# Altium schematic sheet Sheet_1 copy.schdoc
size 438 x 285 mm
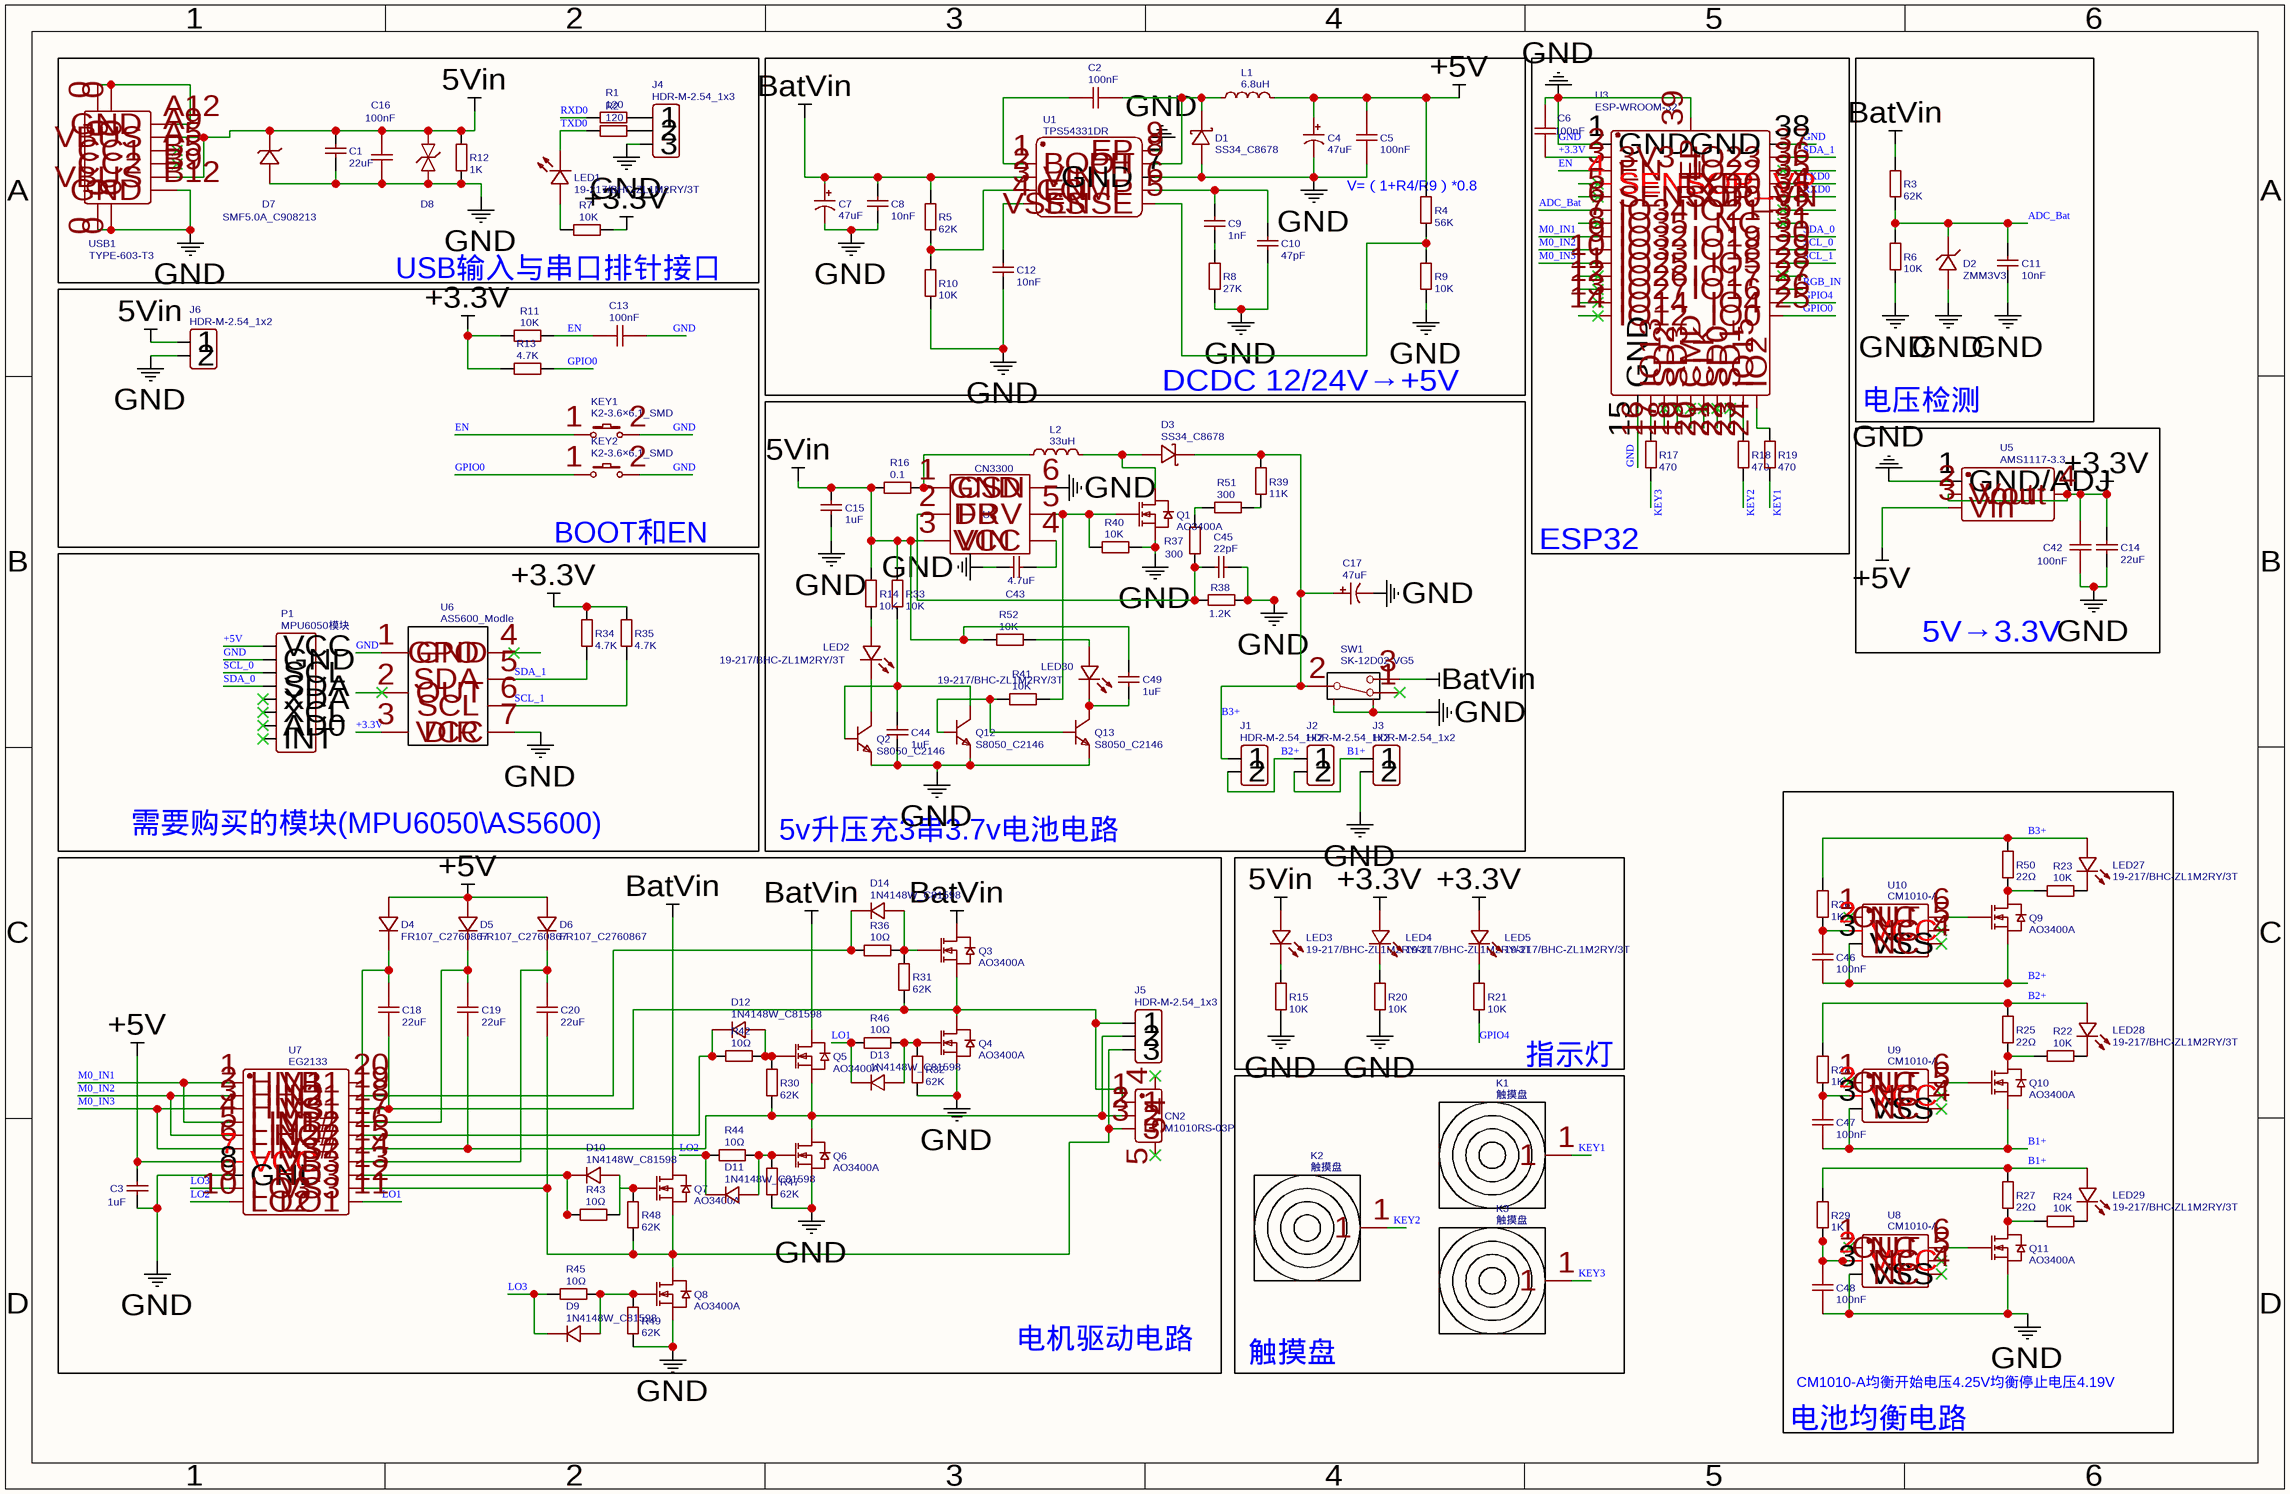
[diagram p0: Sheet_1 copy.schdoc]

## Parts
C1  22uF  [C1206]
C2  100nF  [C0603]
C3  1uF  [C0603]
C4  47uF  [CAP-SMD_BD5.0-L5.3-W5.3-RD]
C5  100nF  [C0603]
C6  100nF  [C0603]
C7  47uF  [CAP-SMD_BD5.0-L5.3-W5.3-RD]
C8  10nF  [C0603]
C9  1nF  [C0603]
C10  47pF  [C0603]
C11  10nF  [C0603]
C12  10nF  [C0603]
C13  100nF  [C0603]
C14  22uF  [C1206]
C15  1uF  [C0603]
C16  100nF  [C0603]
C17  47uF  [CAP-SMD_BD5.0-L5.3-W5.3-RD]
C18  22uF  [C0603]
C19  22uF  [C0603]
C20  22uF  [C0603]
C42  100nF  [C0603]
C43  4.7uF  [C0603]
C44  1uF  [C0603]
C45  22pF  [C0603]
C46  100nF  [C0603]
C47  100nF  [C0603]
C48  100nF  [C0603]
C49  1uF  [C0603]
CN2  M1010RS-03P  [CONN-SMD_M1010RS-03P]
D1  SS34_C8678  [DO-214AC_L4.3-W2.7-LS5.3-RD]
D2  ZMM3V3  [LL-34_L3.5-W1.5-RD]
D3  SS34_C8678  [DO-214AC_L4.3-W2.7-LS5.3-RD]
D4  FR107_C2760867  [SOD-123FL_L2.7-W1.8-LS3.8-RD]
D5  FR107_C2760867  [SOD-123FL_L2.7-W1.8-LS3.8-RD]
D6  FR107_C2760867  [SOD-123FL_L2.7-W1.8-LS3.8-RD]
D7  SMF5.0A_C908213  [SOD-123FL_L2.7-W1.8-LS3.8-RD]
D8  SJD12C6.5L01  [SOD-123_L2.8-W1.8-LS3.7-BI]  (value not drawn)
D9  1N4148W_C81598  [SOD-123F_L2.7-W1.6-LS3.8-RD]
D10  1N4148W_C81598  [SOD-123F_L2.7-W1.6-LS3.8-RD]
D11  1N4148W_C81598  [SOD-123F_L2.7-W1.6-LS3.8-RD]
D12  1N4148W_C81598  [SOD-123F_L2.7-W1.6-LS3.8-RD]
D13  1N4148W_C81598  [SOD-123F_L2.7-W1.6-LS3.8-RD]
D14  1N4148W_C81598  [SOD-123F_L2.7-W1.6-LS3.8-RD]
J1  HDR-M-2.54_1x2  [HDR-M-2.54_1X2]
J2  HDR-M-2.54_1x2  [HDR-M-2.54_1X2]
J3  HDR-M-2.54_1x2  [HDR-M-2.54_1X2]
J4  HDR-M-2.54_1x3  [HDR-M-2.54_1X3]
J5  HDR-M-2.54_1x3  [HDR-M-2.54_1X3]
J6  HDR-M-2.54_1x2  [HDR-M-2.54_1X2]
K1  触摸盘  [TOUCHPAD]
K2  触摸盘  [TOUCHPAD]
K3  触摸盘  [TOUCHPAD]
KEY1  K2-3.6×6.1_SMD  [KEY-SMD_2P-L6.2-W3.6-LS8.0]
KEY2  K2-3.6×6.1_SMD  [KEY-SMD_2P-L6.2-W3.6-LS8.0]
L1  6.8uH  [IND-SMD_L6.0-W6.0_SWPA6045S]
L2  33uH  [IND-SMD_L7.1-W6.6]
LED1  19-217/BHC-ZL1M2RY/3T  [LED0603-R-RD]
LED2  19-217/BHC-ZL1M2RY/3T  [LED0603-R-RD]
LED3  19-217/BHC-ZL1M2RY/3T  [LED0603-R-RD]
LED4  19-217/BHC-ZL1M2RY/3T  [LED0603-R-RD]
LED5  19-217/BHC-ZL1M2RY/3T  [LED0603-R-RD]
LED27  19-217/BHC-ZL1M2RY/3T  [LED0603-R-RD]
LED28  19-217/BHC-ZL1M2RY/3T  [LED0603-R-RD]
LED29  19-217/BHC-ZL1M2RY/3T  [LED0603-R-RD]
LED30  19-217/BHC-ZL1M2RY/3T  [LED0603-R-RD]
P1  MPU6050模块  [MPU6050模块]
Q1  AO3400A  [SOT-23-3_L2.9-W1.6-P1.90-LS2.8-BR]
Q2  S8050_C2146  [SOT-23-3_L3.0-W1.7-P0.95-LS2.9-BR]
Q3  AO3400A  [SOT-23-3_L2.9-W1.6-P1.90-LS2.8-BR]
Q4  AO3400A  [SOT-23-3_L2.9-W1.6-P1.90-LS2.8-BR]
Q5  AO3400A  [SOT-23-3_L2.9-W1.6-P1.90-LS2.8-BR]
Q6  AO3400A  [SOT-23-3_L2.9-W1.6-P1.90-LS2.8-BR]
Q7  AO3400A  [SOT-23-3_L2.9-W1.6-P1.90-LS2.8-BR]
Q8  AO3400A  [SOT-23-3_L2.9-W1.6-P1.90-LS2.8-BR]
Q9  AO3400A  [SOT-23-3_L2.9-W1.6-P1.90-LS2.8-BR]
Q10  AO3400A  [SOT-23-3_L2.9-W1.6-P1.90-LS2.8-BR]
Q11  AO3400A  [SOT-23-3_L2.9-W1.6-P1.90-LS2.8-BR]
Q12  S8050_C2146  [SOT-23-3_L3.0-W1.7-P0.95-LS2.9-BR]
Q13  S8050_C2146  [SOT-23-3_L3.0-W1.7-P0.95-LS2.9-BR]
R1  120  [R0603]
R2  120  [R0603]
R3  62K  [R0603]
R4  56K  [R0603]
R5  62K  [R0603]
R6  10K  [R0603]
R7  10K  [R0603]
R8  27K  [R0603]
R9  10K  [R0603]
R10  10K  [R0603]
R11  10K  [R0603]
R12  1K  [R0603]
R13  4.7K  [R0603]
R14  10K  [R0603]
R15  10K  [R0603]
R16  0.1  [R1206]
R17  470  [R0603]
R18  470  [R0603]
R19  470  [R0603]
R20  10K  [R0603]
R21  10K  [R0603]
R22  10K  [R0603]
R23  10K  [R0603]
R24  10K  [R0603]
R25  22Ω  [R1206]
R26  1K  [R0603]
R27  22Ω  [R1206]
R28  1K  [R0603]
R29  1K  [R0603]
R30  62K  [R0603]
R31  62K  [R0603]
R32  62K  [R0603]
R33  10K  [R0603]
R34  4.7K  [R0603]
R35  4.7K  [R0603]
R36  10Ω  [R0603]
R37  300  [R0603]
R38  1.2K  [R0603]
R39  11K  [R0603]
R40  10K  [R0603]
R41  10K  [R0603]
R42  10Ω  [R0603]
R43  10Ω  [R0603]
R44  10Ω  [R0603]
R45  10Ω  [R0603]
R46  10Ω  [R0603]
R47  62K  [R0603]
R48  62K  [R0603]
R49  62K  [R0603]
R50  22Ω  [R1206]
R51  300  [R0603]
R52  10K  [R0603]
SW1  SK-12D02-VG5  [SW-TH_SK-12D02-VG5]
U1  TPS54331DR  [SOIC-8_L5.0-W4.0-P1.27-LS6.0-BL-EP]
U2  CN3300  [SOT-23-6_L2.9-W1.6-P0.95-LS2.8-BL]
U3  ESP-WROOM-32  [WIFIM-SMD_ESP-WROOM-32]
U5  AMS1117-3.3  [SOT-223-3_L6.5-W3.4-P2.30-LS7.0-BR]
U6  AS5600_Modle  [AS5600_MODLE]
U7  EG2133  [TSSOP-20_L6.5-W4.4-P0.65-LS6.4-BL]
U8  CM1010-A  [SOT-23-6_L2.9-W1.6-P0.95-LS2.8-BR]
U9  CM1010-A  [SOT-23-6_L2.9-W1.6-P0.95-LS2.8-BR]
U10  CM1010-A  [SOT-23-6_L2.9-W1.6-P0.95-LS2.8-BR]
USB1  TYPE-603-T3  [USB-C-SMD_TYPE-603-T3]

## Blocks framed on the sheet
V=（1+R4/R9）*0.8: C2 C4 C5 C7-C10 C12 D1 L1 R4 R5 R8-R10 U1
电压检测: C11 D2 R3 R6
USB输入与串口排针接口: C13 J6 KEY1 KEY2 R11 R13
CM1010-A均衡开始电压4.25V均衡停止电压4.19V: C46-C48 LED27-LED29 Q9-Q11 R22-R29 R50 U8-U10

## Nets
5Vin: C1.2 C15.2 C16.1 C49.1 D7.1(C) D8.2 J6.1 LED3.1(A) R12.1 R14.2 R16.1 R33.2 R52.1 U2.3(VIN) USB1.A9(VBUS) USB1.B9(VBUS)
+3.3V: C6.1 C14.2 C42.2 LED4.1(A) LED5.1(A) R7.2 R11.1 R13.2 R34.2 R35.2 U3.2(3V3) U5.2(Vout) U5.4(Vout) U6.3(VCC)
+5V: C3.2 C4.1 C5.2 D4.2(A) D5.2(A) D6.2(A) L1.2 P1.1(VCC) R4.2 U5.3(Vin) U7.7(VCC)
BatVin: C7.1 C8.2 Q3.3(D) Q5.3(D) Q7.3(D) R3.2 R5.2 SW1.3 U1.2(VIN)
GND: C1.1 C3.1 C4.2 C5.1 C6.2 C7.2 C8.1 C10.1 C11.1 C12.1 C13.1 C14.1 C15.1 C16.2 C17.2 C42.1 C43.1 C44.1 C45.2 C48.2 D1.2(A) D2.2(A) D7.2(A) D8.1 J3.2 J4.3 J6.2 KEY1.2 KEY2.2 P1.2(GND) Q1.2(S) Q2.2(E) Q4.2(S) Q6.2(S) Q8.2(S) Q11.2(S) Q12.2(E) Q13.2(E) R6.1 R8.1 R9.1 R10.1 R12.2 R15.1 R20.1 R32.1 R38.2 R40.1 R47.1 R49.1 SW1.4 SW1.5 U1.7(GND) U1.9(EP) U2.6(GND) U3.1(GND) U3.15(GND) U3.38(GND) U3.39(EP) U5.1(GND/ADJ) U6.1(GND) U6.7(DIR) U7.8(GND) U8.3(VSS) USB1.0 USB1.B12(GND)
ADC_Bat: C11.2 D2.1(C) R3.1 R6.2 U3.6(IO34)
B1+: C47.2 J2.2 J3.1 LED29.1(A) Q10.2(S) R27.2 R29.2 U9.3(VSS)
B2+: C46.2 J1.2 J2.1 LED28.1(A) Q9.2(S) R25.2 R28.2 U10.3(VSS)
B3+: C17.1 D3.1(K) J1.1 LED27.1(A) R26.2 R39.2 R50.2 SW1.2
EN: C13.2 KEY1.1 R11.2 U3.3(EN)
GPIO0: KEY2.1 R13.1 U3.25(IO0)
GPIO4: R21.1 U3.26(IO4)
KEY1: K1.1 R19.1
KEY2: K2.1 R18.1
KEY3: K3.1 R17.1
LO1: D13.1(K) R46.1 U7.11(LO1)
LO2: D11.1(K) R44.1 U7.10(LO2)
LO3: D9.1(K) R45.1 U7.9(LO3)
M0_IN1: U3.8(IO32) U7.1(HIN1) U7.4(LIN1#)
M0_IN2: U3.9(IO33) U7.2(HIN2) U7.5(LIN2#)
M0_IN3: U3.10(IO25) U7.3(HIN3) U7.6(LIN3#)
RGB_IN: U3.27(IO16)
RXD0: R1.1 U3.34(RXD0)
SCL_0: P1.3(SCL) U3.30(IO18)
SCL_1: R35.1 U3.29(IO5) U6.6(SCL)
SDA_0: P1.4(SDA) U3.31(IO19)
SDA_1: R34.1 U3.37(IO23) U6.5(SDA)
TXD0: LED1.2(K) R2.1 U3.35(TXD0)
NetC2_1: C2.1 D1.1(K) L1.1 U1.8(PH)
NetC2_2: C2.2 U1.1(BOOT)
NetC9_1: C9.1 R8.2
NetC9_2: C9.2 C10.2 U1.6(COMP)
NetC12_2: C12.2 U1.4(SS)
NetC18_1: C18.1 C19.1 C20.1 CN2.1 CN2.2 CN2.3 J5.1 J5.2 J5.3 Q3.2(S) Q4.3(D) Q5.2(S) Q6.3(D) Q7.2(S) Q8.3(D) R30.1 R31.1 R48.1 U7.12(VS3) U7.15(VS2) U7.18(VS1)
NetC18_2: C18.2 D4.1(K) U7.20(VB1)
NetC19_2: C19.2 D5.1(K) U7.17(VB2)
NetC20_2: C20.2 D6.1(K) U7.14(VB3)
NetC43_2: C43.2 U2.4(VCC)
NetC44_2: C44.2 Q2.1(B) Q12.3(C) R33.1
NetC45_1: C45.1 R37.1 R38.1 U2.2(FB)
NetC46_1: C46.1 R26.1 U10.2(VCC)
NetC47_1: C47.1 R28.1 U9.2(VCC)
NetC48_1: C48.1 R29.1 U8.2(VCC)
NetC49_2: C49.2 LED30.2(K) Q13.3(C)
NetD3_2: D3.2(A) L2.2 Q1.3(D)
NetD9_2: D9.2(A) Q8.1(G) R45.2 R49.2
NetD10_1: D10.1(K) R43.1 U7.13(HO3)
NetD10_2: D10.2(A) Q7.1(G) R43.2 R48.2
NetD11_2: D11.2(A) Q6.1(G) R44.2 R47.2
NetD12_1: D12.1(K) R42.1 U7.16(HO2)
NetD12_2: D12.2(A) Q5.1(G) R30.2 R42.2
NetD13_2: D13.2(A) Q4.1(G) R32.2 R46.2
NetD14_1: D14.1(K) R36.1 U7.19(HO1)
NetD14_2: D14.2(A) Q3.1(G) R31.2 R36.2
NetJ4_1: J4.1 R1.2
NetJ4_2: J4.2 R2.2
NetL2_1: L2.1 R16.2 U2.1(CSN)
NetLED1_1: LED1.1(A) R7.1
NetLED2_1: LED2.1(A) R14.1
NetLED2_2: LED2.2(K) Q2.3(C)
NetLED3_2: LED3.2(K) R15.2
NetLED4_2: LED4.2(K) R20.2
NetLED5_2: LED5.2(K) R21.2
NetLED27_2: LED27.2(K) R23.2
NetLED28_2: LED28.2(K) R22.2
NetLED29_2: LED29.2(K) R24.2
NetLED30_1: LED30.1(A) R52.2
NetQ1_1: Q1.1(G) R40.2 R41.1 U2.5(DRV)
NetQ9_1: Q9.1(G) U10.6(OUT)
NetQ9_3: Q9.3(D) R23.1 R50.1
NetQ10_1: Q10.1(G) U9.6(OUT)
NetQ10_3: Q10.3(D) R22.1 R25.1
NetQ11_1: Q11.1(G) U8.6(OUT)
NetQ11_3: Q11.3(D) R24.1 R27.1
NetQ12_1: Q12.1(B) Q13.1(B) R41.2
NetR4_1: R4.1 R9.2 U1.5(VSENSE)
NetR5_1: R5.1 R10.2 U1.3(EN)
NetR17_2: R17.2 U3.16(IO13)
NetR18_2: R18.2 U3.23(IO15)
NetR19_2: R19.2 U3.24(IO2)
NetR37_2: R37.2 R51.2
NetR39_1: R39.1 R51.1
NetUSB1_0: USB1.0 USB1.A12(GND)

Not connected (* = marked no-connect by the designer): CN2 4* 5*; P1 5(XDA)* 6(XCL)* 7(AD0)* 8(INT)*; SW1 1*; U3 4(SENSOR_VP)* 5(SENSOR_VN)* 7(IO35)* 11(IO26)* 12(IO27)* 13(IO14)* 14(IO12)* 17(SD2)* 18(SD3)* 19(CMD)* 20(CLK)* 21(SD0)* 22(SD1)* 28(IO17)* 32(NC)* 33(IO21)* 36(IO22)*; U6 2(OUT)* 4(GPO)*; U8 1(NC)* 4(NC)* 5(NC)*; U9 1(NC)* 4(NC)* 5(NC)*; U10 1(NC)* 4(NC)* 5(NC)*; USB1 A5(CC1)* B5(CC2)*

## Notes on the sheet
- DCDC 12/24V→+5V
- (near KEY2) BOOT和EN
- ESP32
- 5V→3.3V
- 需要购买的模块(MPU6050\AS5600)
- 5v升压充3串3.7v电池电路
- 指示灯
- 电机驱动电路
- 触摸盘
- 电池均衡电路

## Library data of the parts
C1 C14 = 22uF: BOM_Manufacturer Part: CL31A226KPHNNNE; BOM_Manufacturer: SAMSUNG; nameAlias: Capacitance; BOM_Supplier: LCSC; BOM_Supplier Part: C5672; BOM_JLCPCB Part Class: Basic Part; spicePre: C; spiceSymbolName: CL31A226KPHNNNE
C2 C5 C6 C13 C16 C42 C46-C48 = 100nF: BOM_Manufacturer: YAGEO; BOM_Manufacturer Part: CC0603KRX7R9BB104; nameAlias: Capacitance; BOM_Supplier: LCSC; BOM_Supplier Part: C14663; BOM_JLCPCB Part Class: Basic Part; spicePre: C; spiceSymbolName: CC0603KRX7R9BB104
C3 C15 C44 C49 = 1uF: BOM_Manufacturer Part: CL10A105KB8NNNC; BOM_Manufacturer: SAMSUNG; nameAlias: Capacitance; BOM_Supplier: LCSC; BOM_Supplier Part: C15849; BOM_JLCPCB Part Class: Basic Part; spicePre: C; spiceSymbolName: CL10A105KB8NNNC
C4 C7 C17 = 47uF: BOM_Manufacturer: SEMTECH; BOM_Manufacturer Part: CS1C470M-CRD54; nameAlias: Capacitance; BOM_Supplier: LCSC; BOM_Supplier Part: C96178; BOM_JLCPCB Part Class: Extended Part; spicePre: C; spiceSymbolName: CS1C470M-CRD54
C8 C11 C12 = 10nF: BOM_Manufacturer: FH; BOM_Manufacturer Part: 0603B103K500NT; nameAlias: Capacitance; BOM_Supplier: LCSC; BOM_Supplier Part: C57112; BOM_JLCPCB Part Class: Basic Part; spicePre: C; spiceSymbolName: 0603B103K500NT
C9 = 1nF: BOM_Manufacturer Part: CL10B102KB8NNNC; BOM_Manufacturer: SAMSUNG; nameAlias: Capacitance; BOM_Supplier: LCSC; BOM_Supplier Part: C1588; BOM_JLCPCB Part Class: Basic Part; spicePre: C; spiceSymbolName: CL10B102KB8NNNC
C10 = 47pF: BOM_Manufacturer Part: CL10C470JB8NNNC; BOM_Manufacturer: SAMSUNG; nameAlias: Capacitance; BOM_Supplier: LCSC; BOM_Supplier Part: C1671; BOM_JLCPCB Part Class: Basic Part; spicePre: C; spiceSymbolName: CL10C470JB8NNNC
C18-C20 = 22uF: BOM_Manufacturer: SAMSUNG; BOM_Manufacturer Part: CL10A226MQ8NRNC; nameAlias: Capacitance; BOM_Supplier: LCSC; BOM_Supplier Part: C59461; BOM_JLCPCB Part Class: Basic Part; spicePre: C; spiceSymbolName: CL10A226MQ8NRNC
C43 = 4.7uF: BOM_Manufacturer Part: CL10A475KO8NNNC; BOM_Manufacturer: SAMSUNG; nameAlias: Capacitance; BOM_Supplier: LCSC; BOM_Supplier Part: C19666; BOM_JLCPCB Part Class: Basic Part; spicePre: C; spiceSymbolName: CL10A475KO8NNNC
C45 = 22pF: BOM_Manufacturer Part: CL10C220JB8NNNC; BOM_Manufacturer: SAMSUNG; nameAlias: Capacitance; BOM_Supplier: LCSC; BOM_Supplier Part: C1653; BOM_JLCPCB Part Class: Basic Part; spicePre: C; spiceSymbolName: CL10C220JB8NNNC
CN2 = M1010RS-03P: BOM_Manufacturer: XFCN(台湾兴飞); Contributor: LCSC; BOM_Supplier: LCSC; BOM_Supplier Part: C541845; BOM_Manufacturer Part: M1010RS-03P; BOM_JLCPCB Part Class: Extended Part; spicePre: C; spiceSymbolName: M1010RS-03P
D1 D3 = SS34_C8678: BOM_Manufacturer Part: SS34; BOM_Manufacturer: MDD; BOM_Supplier: LCSC; BOM_Supplier Part: C8678; BOM_JLCPCB Part Class: Basic Part; spicePre: D; spiceSymbolName: SS34_C8678
D2 = ZMM3V3: BOM_Manufacturer: SEMTECH; BOM_Supplier: LCSC; BOM_Manufacturer Part: ZMM3V3; BOM_Supplier Part: C8056; BOM_JLCPCB Part Class: Basic Part; spicePre: D; spiceSymbolName: ZMM3V3
D4-D6 = FR107_C2760867: BOM_Manufacturer: Slkor(萨科微); BOM_Manufacturer Part: FR107; Contributor: LCSC; BOM_Supplier: LCSC; BOM_Supplier Part: C2760867; BOM_JLCPCB Part Class: Extended Part; spicePre: D; spiceSymbolName: FR107_C2760867
D7 = SMF5.0A_C908213: BOM_Manufacturer: FUXINSEMI; Contributor: LCSC; BOM_Supplier: LCSC; BOM_Supplier Part: C908213; BOM_Manufacturer Part: SMF5.0A; BOM_JLCPCB Part Class: Extended Part; spicePre: D; spiceSymbolName: SMF5.0A_C908213
D8 = SJD12C6.5L01: BOM_Manufacturer: Brightking Elec (TAIWAN); Contributor: LCSC; BOM_Supplier: LCSC; BOM_Supplier Part: C313294; BOM_Manufacturer Part: SJD12C6.5L01; spicePre: D; spiceSymbolName: SJD12C6.5L01
D9-D14 = 1N4148W_C81598: BOM_Manufacturer: SEMTECH; BOM_Supplier: LCSC; BOM_Manufacturer Part: 1N4148W; BOM_Supplier Part: C81598; BOM_JLCPCB Part Class: Basic Part; spicePre: D; spiceSymbolName: 1N4148W_C81598
J1-J3 J6 = HDR-M-2.54_1x2: Contributor: LCEDA_Lib; BOM_Supplier Part: C124375; BOM_Supplier: LCSC; spicePre: J; spiceSymbolName: HDR-M-2.54_1x2
J4 J5 = HDR-M-2.54_1x3: Contributor: LCEDA_Lib; BOM_Supplier Part: C180248; BOM_Supplier: LCSC; spicePre: J; spiceSymbolName: HDR-M-2.54_1x3
K1-K3 = 触摸盘: Contributor: Lisdon; spicePre: U
KEY1 KEY2 = K2-3.6×6.1_SMD: BOM_Manufacturer Part: K2-1107ST-A4SW-06; Contributor: LCEDA_Lib; 制造商: 韩国韩荣; BOM_Supplier Part: C118141; BOM_Supplier: LCSC; spicePre: K; spiceSymbolName: K2-3.6×6.1_SMD
L1 = 6.8uH: BOM_Manufacturer: Sunlord; BOM_Manufacturer Part: SWPA6045S6R8MT; nameAlias: Inductance; BOM_Supplier: LCSC; BOM_Supplier Part: C57254; BOM_JLCPCB Part Class: Extended Part; spicePre: L; spiceSymbolName: SWPA6045S6R8MT
L2 = 33uH: BOM_Manufacturer: Sunltech Tech; BOM_Manufacturer Part: SLO0630H330MTT; nameAlias: Inductance; Contributor: LCSC; BOM_Supplier: LCSC; BOM_Supplier Part: C207844; BOM_JLCPCB Part Class: Extended Part; spicePre: L; spiceSymbolName: SLO0630H330MTT
LED1-LED5 LED27-LED30 = 19-217/BHC-ZL1M2RY/3T: BOM_Manufacturer: EVERLIGHT; BOM_Supplier: LCSC; BOM_Manufacturer Part: 19-217/BHC-ZL1M2RY/3T; BOM_Supplier Part: C72041; BOM_JLCPCB Part Class: Basic Part; spicePre: L; spiceSymbolName: KT-0603R
Q1 Q3-Q11 = AO3400A: BOM_Manufacturer: AOS; BOM_Supplier: LCSC; BOM_Manufacturer Part: AO3400A; BOM_Supplier Part: C20917; BOM_JLCPCB Part Class: Basic Part; spicePre: Q; spiceSymbolName: AO3400A
Q2 Q12 Q13 = S8050_C2146: BOM_Manufacturer: CJ; BOM_Manufacturer Part: S8050; BOM_Supplier: LCSC; BOM_Supplier Part: C2146; BOM_JLCPCB Part Class: Basic Part; spicePre: Q; spiceSymbolName: S8050_C2146
R1 R2 = 120: BOM_Manufacturer: UniOhm; BOM_Manufacturer Part: 0603WAF1200T5E; nameAlias: Resistance (Ohms); BOM_Supplier: LCSC; BOM_Supplier Part: C22787; BOM_JLCPCB Part Class: Basic Part; spicePre: R; spiceSymbolName: 0603WAF1200T5E
R3 R5 R30-R32 R47-R49 = 62K: BOM_Manufacturer: UniOhm; BOM_Manufacturer Part: 0603WAF6202T5E; nameAlias: Resistance (Ohms); BOM_Supplier: LCSC; BOM_Supplier Part: C23221; BOM_JLCPCB Part Class: Basic Part; spicePre: R
  R3 R5: spiceSymbolName: 0603WAF6202T5E
  R30-R32 R47-R49: spiceSymbolName: 0603WAF1002T5E
R4 = 56K: BOM_Manufacturer: UniOhm; BOM_Manufacturer Part: 0603WAF5602T5E; nameAlias: Resistance (Ohms); BOM_Supplier: LCSC; BOM_Supplier Part: C23206; BOM_JLCPCB Part Class: Basic Part; spicePre: R; spiceSymbolName: 0603WAF5602T5E
R6 R7 R9-R11 R14 R15 R20-R24 R33 R40 R41 R52 = 10K: BOM_Manufacturer: UniOhm; BOM_Manufacturer Part: 0603WAF1002T5E; nameAlias: Resistance (Ohms); BOM_Supplier: LCSC; BOM_Supplier Part: C25804; BOM_JLCPCB Part Class: Basic Part; spicePre: R; spiceSymbolName: 0603WAF1002T5E
R8 = 27K: BOM_Manufacturer: UniOhm; BOM_Manufacturer Part: 0603WAF2702T5E; nameAlias: Resistance (Ohms); BOM_Supplier: LCSC; BOM_Supplier Part: C22967; BOM_JLCPCB Part Class: Basic Part; spicePre: R; spiceSymbolName: 0603WAF2702T5E
R12 R26 R28 R29 = 1K: BOM_Manufacturer: UniOhm; BOM_Manufacturer Part: 0603WAF1001T5E; nameAlias: Resistance (Ohms); BOM_Supplier: LCSC; BOM_Supplier Part: C21190; BOM_JLCPCB Part Class: Basic Part; spicePre: R; spiceSymbolName: 0603WAF1001T5E
R13 R34 R35 = 4.7K: BOM_Manufacturer: UniOhm; BOM_Manufacturer Part: 0603WAF4701T5E; nameAlias: Resistance (Ohms); BOM_Supplier: LCSC; BOM_Supplier Part: C23162; BOM_JLCPCB Part Class: Basic Part; spicePre: R; spiceSymbolName: 0603WAF4701T5E
R16 = 0.1: BOM_Manufacturer: UniOhm; BOM_Manufacturer Part: 1206W4F100LT5E; nameAlias: Resistance (Ohms); BOM_Supplier: LCSC; BOM_Supplier Part: C25334; BOM_JLCPCB Part Class: Basic Part; spicePre: R; spiceSymbolName: 1206W4F100LT5E
R17-R19 = 470: BOM_Manufacturer: UniOhm; BOM_Manufacturer Part: 0603WAF4700T5E; nameAlias: Resistance (Ohms); BOM_Supplier: LCSC; BOM_Supplier Part: C23179; BOM_JLCPCB Part Class: Basic Part; spicePre: R; spiceSymbolName: 0603WAF4700T5E
R25 R27 R50 = 22Ω: BOM_Manufacturer: UniOhm; BOM_Manufacturer Part: 1206W4F220JT5E; nameAlias: Resistance; Resistance (Ohms): 22; BOM_Supplier: LCSC; BOM_Supplier Part: C17958; BOM_JLCPCB Part Class: Basic Part; spicePre: R; spiceSymbolName: 1206W4F220JT5E
R36 R42-R46 = 10Ω: BOM_Manufacturer: UniOhm; BOM_Manufacturer Part: 0603WAF100JT5E; nameAlias: Resistance; BOM_Supplier: LCSC; BOM_Supplier Part: C22859; Resistance (Ohms): 10Ω; BOM_JLCPCB Part Class: Basic Part; spicePre: R; spiceSymbolName: 0603WAF100JT5E
R37 R51 = 300: BOM_Manufacturer: UniOhm; BOM_Manufacturer Part: 0603WAF3000T5E; nameAlias: Resistance (Ohms); BOM_Supplier: LCSC; BOM_Supplier Part: C23025; BOM_JLCPCB Part Class: Basic Part; spicePre: R; spiceSymbolName: 0603WAF3000T5E
R38 = 1.2K: BOM_Manufacturer: UniOhm; BOM_Manufacturer Part: 0603WAF1201T5E; nameAlias: Resistance (Ohms); BOM_Supplier: LCSC; BOM_Supplier Part: C22765; BOM_JLCPCB Part Class: Basic Part; spicePre: R; spiceSymbolName: 0603WAF1201T5E
R39 = 11K: BOM_Manufacturer: UniOhm; BOM_Manufacturer Part: 0603WAF1102T5E; nameAlias: Resistance (Ohms); BOM_Supplier: LCSC; BOM_Supplier Part: C25950; BOM_JLCPCB Part Class: Basic Part; spicePre: R; spiceSymbolName: 0603WAF1102T5E
SW1 = SK-12D02-VG5: BOM_Manufacturer: Rectangular Connectors - Contacts; Contributor: LCSC; BOM_Supplier: LCSC; BOM_Supplier Part: C136722; BOM_Manufacturer Part: SK-12D02-VG5; spicePre: S; spiceSymbolName: SK-12D02-VG5; BOM_JLCPCB Part Class: Extended Part
U1 = TPS54331DR: BOM_Manufacturer: TI; Contributor: 13471635540; SMT Type: Basic Part; BOM_Supplier: LCSC; BOM_Manufacturer Part: TPS54331DR; BOM_Supplier Part: C9865; BOM_LCSC Assembly: Yes; spicePre: U; spiceSymbolName: TPS54331DDAR
U2 = CN3300: BOM_Manufacturer: CONSONANCE; SMT Type: Extend; BOM_Supplier: LCSC; BOM_Manufacturer Part: CN3300; BOM_Supplier Part: C52375; BOM_LCSC Assembly: Yes; spicePre: U; spiceSymbolName: CN3300
U3 = ESP-WROOM-32: BOM_Manufacturer: ESPRESSIF; BOM_Supplier: LCSC; BOM_Manufacturer Part: ESP-WROOM-32; BOM_Supplier Part: C95209; spicePre: U; spiceSymbolName: ESP-WROOM-32
U5 = AMS1117-3.3: BOM_Manufacturer: AMS; sourceId: dwIGgezVh; timeStamp: 1476261164; BOM_Supplier: LCSC; BOM_Manufacturer Part: AMS1117-3.3; BOM_Supplier Part: C6186; BOM_JLCPCB Part Class: Basic Part; JLCPCB Part Class: Basic Part; spicePre: U; spiceSymbolName: AMS1117-3.3
U6 = AS5600_Modle: Contributor: 45coll; spicePre: U; spiceSymbolName: AS5600_Modle; 淘宝ID: https://item.taobao.com/item.htm?spm=a1z09.2.0.0.2d022e8duL4IzW&id=622544987536&_u=31sddf3scb0c
U7 = EG2133: BOM_Manufacturer: EG Micro; Contributor: LCSC; BOM_Supplier: LCSC; BOM_Supplier Part: C190343; BOM_Manufacturer Part: EG2133; BOM_JLCPCB Part Class: Extended Part; spicePre: U; spiceSymbolName: EG2133
U8-U10 = CM1010-A: BOM_Manufacturer: iCM(创芯微); Contributor: LCSC; BOM_Supplier: LCSC; BOM_Supplier Part: C2685539; BOM_Manufacturer Part: CM1010-A; BOM_JLCPCB Part Class: Extended Part; spicePre: U; spiceSymbolName: CM1010-A
USB1 = TYPE-603-T3: BOM_Manufacturer: Yuandi(台湾元迪); Contributor: LCSC; BOM_Supplier: LCSC; BOM_Supplier Part: C2689837; BOM_Manufacturer Part: TYPE-603-T3; BOM_JLCPCB Part Class: Extended Part; spicePre: U; spiceSymbolName: TYPE-603-T3
P1 = MPU6050模块: spicePre: P; spiceSymbolName: MPU6050模块